# Altium schematic sheet Block Diagram.SchDoc: Interface Block Diagram
size A4; DrawnBy: ThanhQuoc; Revision: V01; SheetNumber: 1; SheetTotal: 18; Project: RV1126 CAMERA BOARD DESIGN
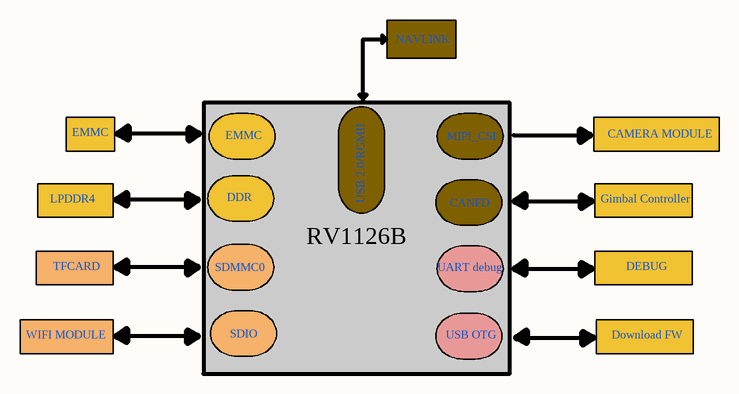
[diagram p0: Block Diagram.SchDoc]

## Notes on the sheet
- NAVLINK
- EMMC
- MIPI_CSI
- CAMERA MODULE
- LPDDR4
- DDR
- USB 2.0/RGMII
- CANFD
- Gimbal Controller
- TFCARD
- SDMMC0
- RV1126B
- UART debug
- DEBUG
- WIFI MODULE
- SDIO
- USB OTG
- Download FW
- Title:
- Drawn By:
- Page Contents:
- Checked By:
- Size:
- Date:
- File:
- License:
- Email:
- A4
- nguyenthanhquoc0206@gmail.com
- Number:
- Time:
- Revision:
- Sheet
- Website:
- of
- https://www.facebook.com/ntq.687